# EAGLE schematic Sumobot (EAGLE 8.2.1)
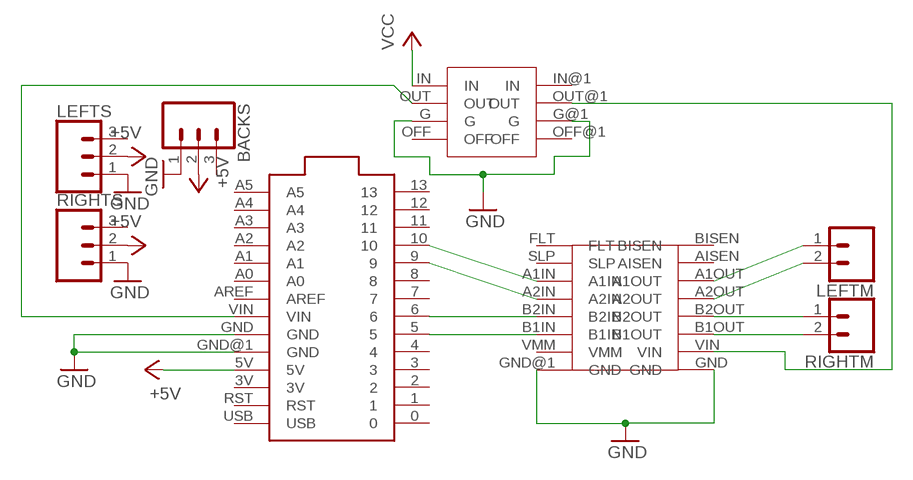
[diagram p0: schematic, sheet 1]

## Parts
BACKS  CONN_03LONGPADS  [1X03_LONGPADS]
LEFTM  CONN_02LOCK_LONGPADS  [1X02_LOCK_LONGPADS]
LEFTS  CONN_03LONGPADS  [1X03_LONGPADS]
METROMINI  METROMINI  [METROMINI]
MOTORDRIVER  MOTORDRIVER  [MOTORDRIVER]
RIGHTM  CONN_02LOCK_LONGPADS  [1X02_LOCK_LONGPADS]
RIGHTS  CONN_03LONGPADS  [1X03_LONGPADS]
SPSWITCH]  SPSWITCH  [SPSWITCH]

## Nets
+5V: METROMINI.5V
GND: METROMINI.GND METROMINI.GND@1(GND) MOTORDRIVER.GND MOTORDRIVER.GND@1(GND) SPSWITCH].G SPSWITCH].G@1(G)
N$1: METROMINI.10 MOTORDRIVER.A1IN
N$2: METROMINI.9 MOTORDRIVER.A2IN
N$3: METROMINI.6 MOTORDRIVER.B2IN
N$4: METROMINI.5 MOTORDRIVER.B1IN
N$5: METROMINI.VIN SPSWITCH].OUT
N$6: MOTORDRIVER.VIN SPSWITCH].OUT@1(OUT)
N$7: MOTORDRIVER.B1OUT RIGHTM.2
N$8: MOTORDRIVER.B2OUT RIGHTM.1
N$9: LEFTM.1 MOTORDRIVER.A1OUT
N$10: LEFTM.2 MOTORDRIVER.A2OUT
VCC: SPSWITCH].IN
Unconnected: BACKS.1 BACKS.2 BACKS.3 LEFTS.1 LEFTS.2 LEFTS.3 METROMINI.0 METROMINI.1 METROMINI.2 METROMINI.3 METROMINI.3V METROMINI.4 METROMINI.7 METROMINI.8 METROMINI.11 METROMINI.12 METROMINI.13 METROMINI.A0 METROMINI.A1 METROMINI.A2 METROMINI.A3 METROMINI.A4 METROMINI.A5 METROMINI.AREF METROMINI.RST METROMINI.USB MOTORDRIVER.AISEN MOTORDRIVER.BISEN MOTORDRIVER.FLT MOTORDRIVER.SLP MOTORDRIVER.VMM RIGHTS.1 RIGHTS.2 RIGHTS.3 SPSWITCH].IN@1(IN) SPSWITCH].OFF SPSWITCH].OFF@1(OFF)

## Library data of the parts
BACKS LEFTS RIGHTS = SparkFun-Connectors:CONN_03: Multi connection point. Often used as Generic Header-pin footprint for 0.1 inch spaced/style header connections On any of the 0.1 inch spaced packages, you can populate with these: Break Away Headers - Straight <https://www.sparkfun.com/products/116> (PRT-00116) Break Away Male Headers - Right Angle <https://www.sparkfun.com/products/553> (PRT-00553) Female Headers <https://www.sparkfun.com/products/115> (PRT-00115) Break Away Headers - Machine Pin <https://www.sparkfun.com/products/117> (PRT-00117) Break Away Female Headers - Swiss Machine Pin <https://www.sparkfun.com/products/743> (PRT-00743) Stackable Header - 3 Pin (Female, 0.1") <https://www.sparkfun.com/products/13875> (PRT-13875) For SCREWTERMINALS and SPRING TERMINALS visit here: Screw Terimnals on SparkFun.com <https://www.sparkfun.com/search/results?term=Screw+Terminals> (5mm/3.5mm/2.54mm spacing) This device is also useful as a general connection point to wire up your design to another part of your project. Our various solder wires solder well into these plated through hole pads. Hook-Up Wire - Assortment (Stranded, 22 AWG) <https://www.sparkfun.com/products/11375> (PRT-11375) Hook-Up Wire - Assortment (Solid Core, 22 AWG) <https://www.sparkfun.com/products/11367> (PRT-11367) View the entire wire category on our website here <https://www.sparkfun.com/categories/141> Special notes: Molex polarized connector foot print use with SKU : PRT-08232 with associated crimp pins and housings.
LEFTM RIGHTM = SparkFun-Connectors:CONN_02: Multi connection point. Often used as Generic Header-pin footprint for 0.1 inch spaced/style header connections On any of the 0.1 inch spaced packages, you can populate with these: Break Away Headers - Straight <https://www.sparkfun.com/products/116> (PRT-00116) Break Away Male Headers - Right Angle <https://www.sparkfun.com/products/553> (PRT-00553) Female Headers <https://www.sparkfun.com/products/115> (PRT-00115) Break Away Headers - Machine Pin <https://www.sparkfun.com/products/117> (PRT-00117) Break Away Female Headers - Swiss Machine Pin <https://www.sparkfun.com/products/743> (PRT-00743) For SCREWTERMINALS and SPRING TERMINALS visit here: Screw Terimnals on SparkFun.com <https://www.sparkfun.com/search/results?term=Screw+Terminals> (5mm/3.5mm/2.54mm spacing) This device is also useful as a general connection point to wire up your design to another part of your project. Our various solder wires solder well into these plated through hole pads. Hook-Up Wire - Assortment (Stranded, 22 AWG) <https://www.sparkfun.com/products/11375> (PRT-11375) Hook-Up Wire - Assortment (Solid Core, 22 AWG) <https://www.sparkfun.com/products/11367> (PRT-11367) View the entire wire category on our website here <https://www.sparkfun.com/categories/141> Special notes: Molex polarized connector foot print use with: PRT-08233 with associated crimp pins and housings. 2.54_SCREWTERM for use with PRT-10571. 3.5mm Screw Terminal footprints for PRT-08084 5mm Screw Terminal footprints for use with PRT-08432
METROMINI = Sumobot:METROMINI
MOTORDRIVER = Sumobot:MOTORDRIVER
SPSWITCH] = Sumobot:SPSWITCH